# EAGLE design SilentStepStick-TMC2209_v20 (EAGLE 7.7.0)
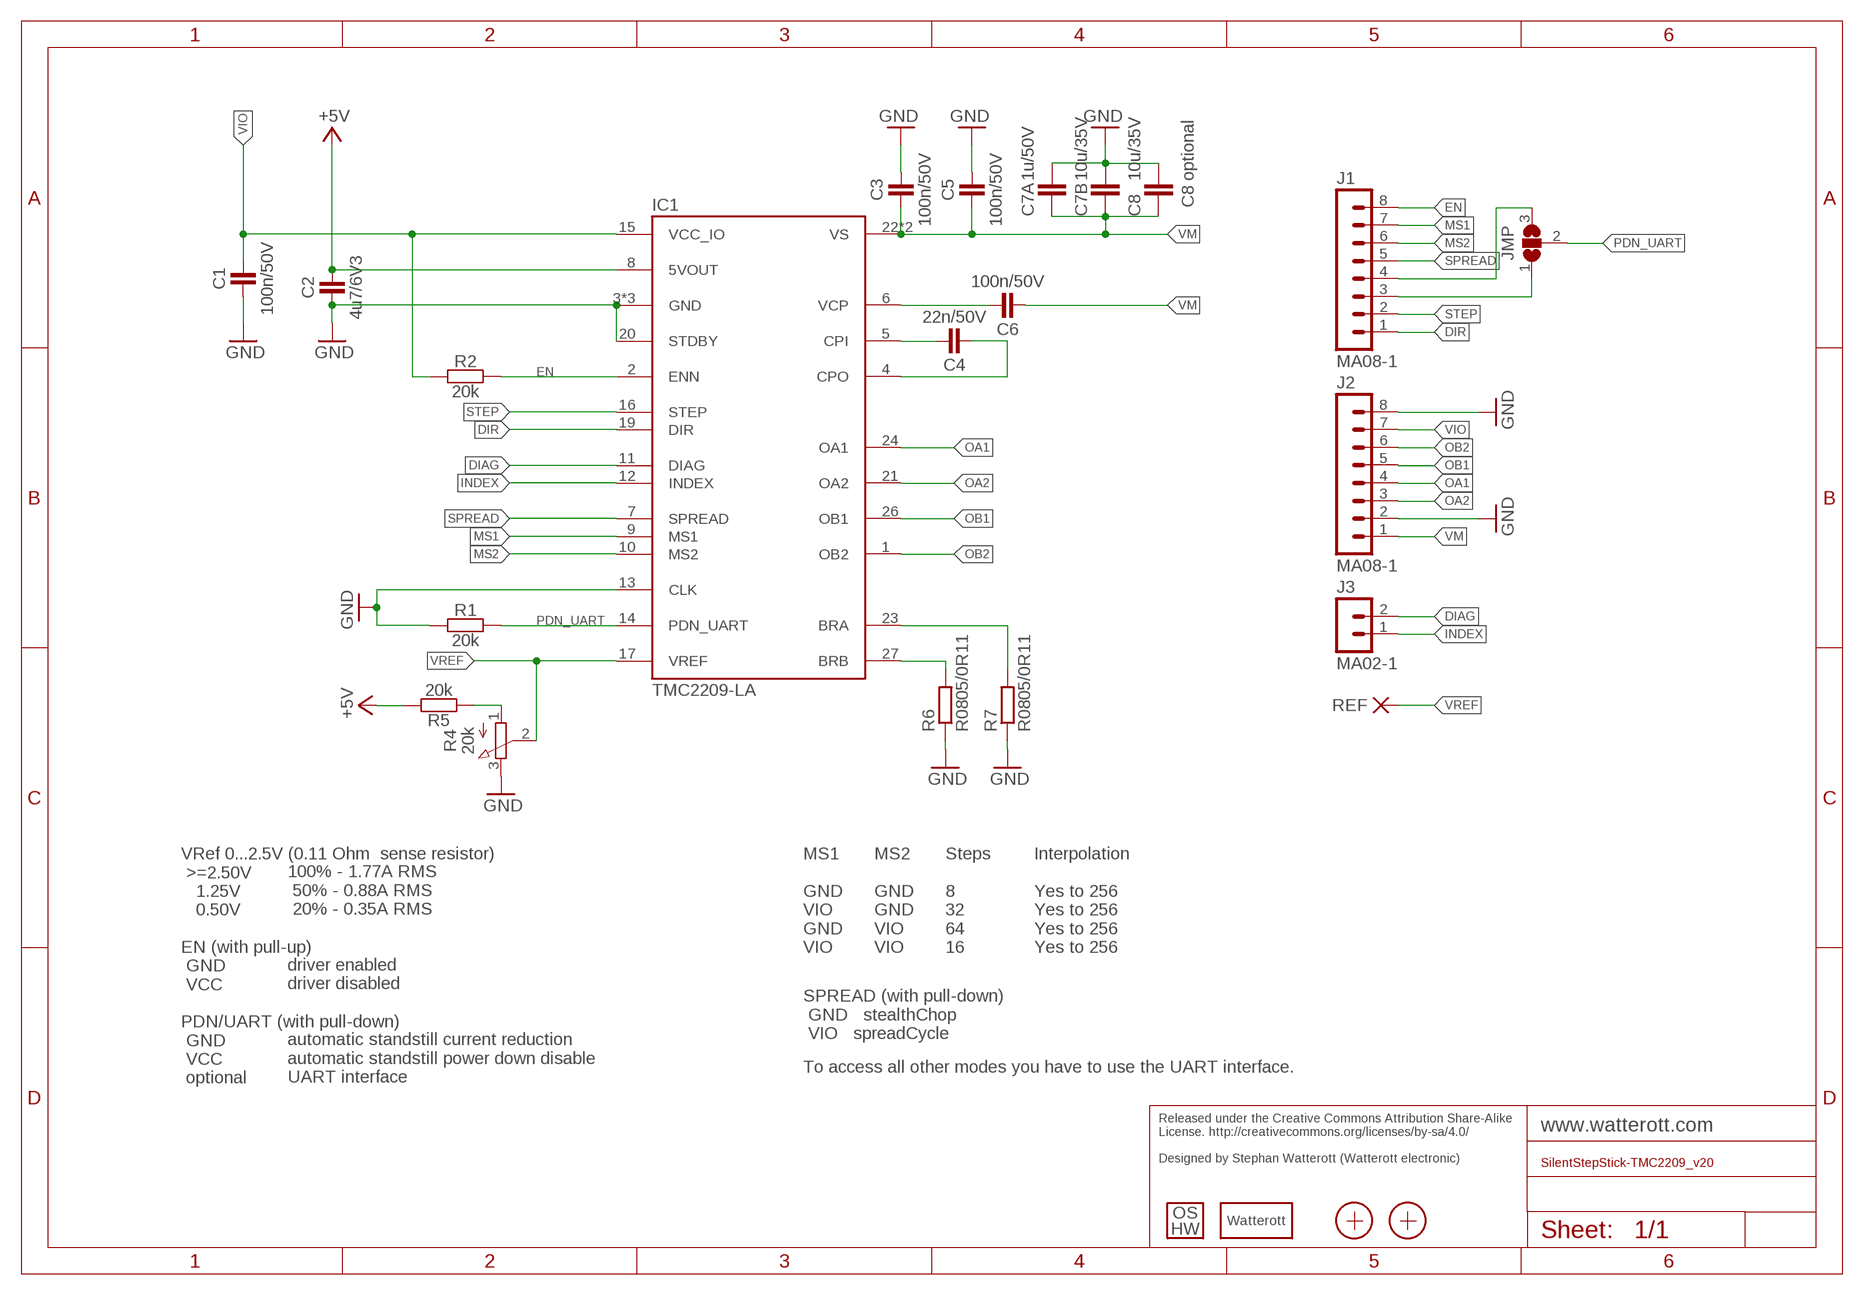
[diagram p0: schematic, sheet 1]

## Parts
C1  100n/50V  CAPACITOR-0402  [C0402]
C2  4u7/6V3  CAPACITOR-0402  [C0402]
C3  100n/50V  CAPACITOR-0402  [C0402]
C4  22n/50V  CAPACITOR-0402  [C0402]
C5  100n/50V  CAPACITOR-0402  [C0402]
C6  100n/50V  CAPACITOR-0402  [C0402]
C7A  1u/50V  C-EUC0805  [C0805]
C7B  10u/35V  C-EUC1206  [C1206]
C8  10u/35V  C-EUC1206  [C1206]
IC1  TMC2209-LA  [QFN28-PAD3.7]
J1  MA08-1  [MA08-1]
J2  MA08-1  [MA08-1]
J3  MA02-1  [MA02-1]
JMP  JUMPER3-0402-NC  [JUMPER3-0402_NC]
LOGO3  LOGO_SPARK-2  [SPARK_2MM]
LOGO4  LOGO_OSHW-2  [OSHW_2MM]
R1  20k  RESISTOR-0402  [C0402]
R2  20k  RESISTOR-0402  [C0402]
R4  20k  POT-EVM3R  [POT_EVM3R]
R5  20k  RESISTOR-0402  [C0402]
R6  R0805/0R11  R-EU_M0805  [M0805]
R7  R0805/0R11  R-EU_M0805  [M0805]
REF  PAD-0.6-1.1  [PAD-0.6-1.1]
X1  PASSER-04  [PASSER_04MM]
X2  PASSER-04  [PASSER_04MM]

## Nets
+5V: C2.2 IC1.8(5VOUT) R5.2
BRA: IC1.23(BRA) R7.2
BRB: IC1.27(BRB) R6.2
CPI: C4.2 IC1.5(CPI)
CPO: C4.1 IC1.4(CPO)
DIAG: IC1.11(DIAG) J3.2
DIR: IC1.19(DIR) J1.1
EN: IC1.2(ENN) J1.8 R2.2
GND: C1.1 C2.1 C3.2 C5.2 C7A.2 C7B.2 C8.2 IC1.3(GND) IC1.13(CLK) IC1.18(GND) IC1.20(STDBY) IC1.TP(GND) J2.2 J2.8 R1.1 R4.3(E) R6.1 R7.1
INDEX: IC1.12(INDEX) J3.1
MS1: IC1.9(MS1) J1.7
MS2: IC1.10(MS2) J1.6
N$1: J1.4 JMP.3
N$2: J1.3 JMP.1
OA1: IC1.24(OA1) J2.4
OA2: IC1.21(OA2) J2.3
OB1: IC1.26(OB1) J2.5
OB2: IC1.1(OB2) J2.6
PDN_UART: IC1.14(PDN_UART) JMP.2 R1.2
SPREAD: IC1.7(SPREAD) J1.5
STEP: IC1.16(STEP) J1.2
VCP: C6.2 IC1.6(VCP)
VIO: C1.2 IC1.15(VCC_IO) J2.7 R2.1
VM: C3.1 C5.1 C6.1 C7A.1 C7B.1 C8.1 IC1.22(VS) IC1.28(VS) J2.1
VREF: IC1.17(VREF) R4.2(S) REF.1(P)
VREF1: R4.1(A) R5.1

## Notes on the sheet
- C8 optional
- VRef 0...2.5V (0.11 Ohm  sense resistor)
   >=2.50V
     1.25V
     0.50V
  
  EN (with pull-up)
   GND
   VCC
  
  PDN/UART (with pull-down)
   GND
   VCC
   optional
- MS1
  
  GND
  VIO
  GND
  VIO
- MS2
  
  GND
  GND
  VIO
  VIO
- Steps
  
  8
  32
  64
  16
- Interpolation
  
  Yes to 256
  Yes to 256
  Yes to 256
  Yes to 256
- 100% - 1.77A RMS
   50% - 0.88A RMS
   20% - 0.35A RMS
  
  
  driver enabled
  driver disabled
  
  
  automatic standstill current reduction
  automatic standstill power down disable
  UART interface
- SPREAD (with pull-down)
   GND   stealthChop
   VIO   spreadCycle
- To access all other modes you have to use the UART interface.
- Released under the Creative Commons Attribution Share-Alike 
  License. http://creativecommons.org/licenses/by-sa/4.0/
  
  Designed by Stephan Watterott (Watterott electronic)

## Library data of the parts
C1-C6 = we-rcl:CAPACITOR: Capacitor ...2.2uF @ 6.3V -> 0402 ...4.7uF @ 6.3V -> 0603 ...10uF @ 16V -> 0805 ...22uF @ 25V -> 1206
C7A C7B C8 = rcl:C-EU: CAPACITOR, European symbol
IC1 = we-chip:TMC2209: Trinamic TMC2209 Stepper Motor Driver (5V...28V, 1.8A RMS, 256 microsteps)
J1 J2 = we-con:MA08-1: Pin Header
J3 = we-con:MA02-1: Pin Header
JMP = we-rcl:JUMPER3: 3-Pin Jumper
LOGO3 = we-symbol:LOGO_SPARK: Watterott electronic Logo
LOGO4 = we-symbol:LOGO_OSHW: Open-Source-Hardware Logo
R1 R2 R5 = we-rcl:RESISTOR: Resistor all kinds in 0402 and 0603
R4 = we-rcl:POT: Potentiometer
R6 R7 = rcl:R-EU_: RESISTOR, European symbol
REF = we-rcl:PAD: Pad / Test-Point
X1 X2 = we-symbol:PASSER: Fiducial Marker

## Board
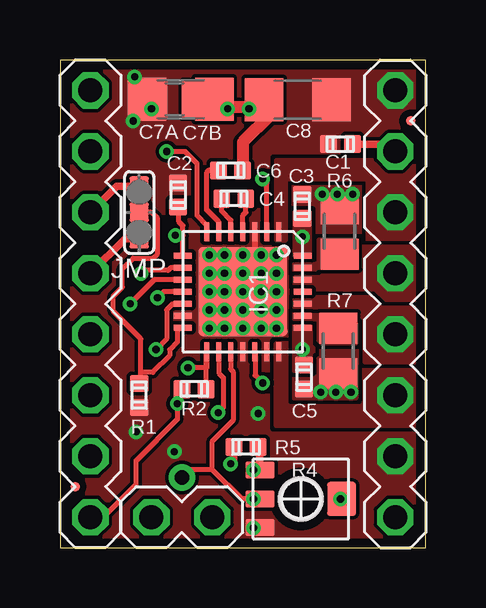
[diagram p1: board, top side]
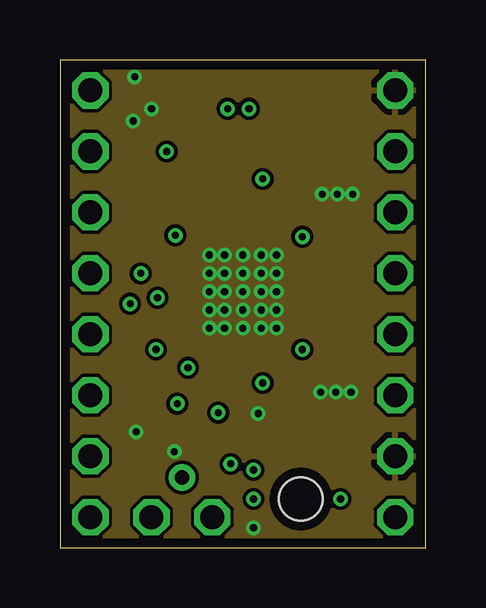
[diagram p2: board, inner layer Ground]
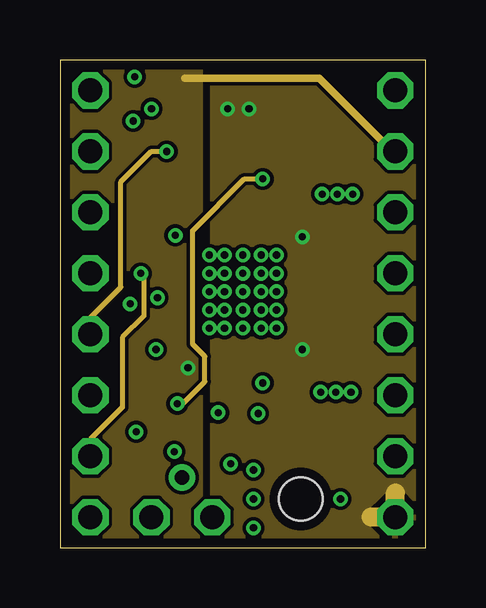
[diagram p3: board, inner layer Supply]
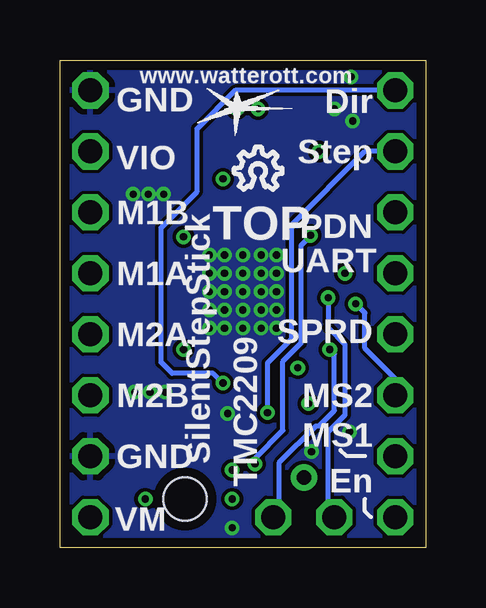
[diagram p4: board, bottom side, seen from below]

Size 15.24 x 20.32 mm. Coordinates in mm from the lower left corner, seen from the top.
Outline: 0,0 15.24,0 15.24,20.32 0,20.32 0,0
Copper layers (1+2*15+16): Top 0.035mm / dielectric 0.35mm / Ground 0.035mm / dielectric 0.76mm / Supply 0.035mm / dielectric 0.35mm / Bottom 0.035mm
Design rules "Default_WE_Euro *": minimum track width 0.15mm, minimum drill 0.25mm, track to track 0.15mm, track to pad 0.15mm, pad to pad 0.15mm, via to via 0.15mm, smd to smd 0mil, copper to edge 0.4mm, drill to drill 8mil, minimum pad ring 10mil, minimum via ring 6mil, stop-mask expansion 2mil, vias tented up to drill 0.5mm, thermal gap 10mil

### Footprints (pad centres in the part's own frame; a part is rotated, then mirrored left to right if it is on the bottom)
C0402 = smd 0.75 x 0.7: 1 0,0.5; 2 0,-0.5
C0805 = smd 1.3 x 1.5: 1 -0.95,0; 2 0.95,0
C1206 = smd 1.6 x 1.8: 1 -1.4,0; 2 1.4,0
QFN28-PAD3.7 = smd 0.8 x 0.26: 1 -2.5,1.5; 2 -2.5,1; 3 -2.5,0.5; 4 -2.5,0; 5 -2.5,-0.5; 6 -2.5,-1; 7 -2.5,-1.5; 15 2.5,-1.5; 16 2.5,-1; 17 2.5,-0.5; 18 2.5,0; 19 2.5,0.5; 20 2.5,1; 21 2.5,1.5 | smd 0.26 x 0.8: 8 -1.5,-2.5; 9 -1,-2.5; 10 -0.5,-2.5; 11 0,-2.5; 12 0.5,-2.5; 13 1,-2.5; 14 1.5,-2.5; 22 1.5,2.5; 23 1,2.5; 24 0.5,2.5; 25 0,2.5; 26 -0.5,2.5; 27 -1,2.5; 28 -1.5,2.5 | smd 3.7 x 3.7: TP 0,0
MA08-1 = drill 1 octagon: 1 0,8.89; 2 0,6.35; 3 0,3.81; 4 0,1.27; 5 0,-1.27; 6 0,-3.81; 7 0,-6.35; 8 0,-8.89
MA02-1 = drill 1 octagon: 1 0,1.27; 2 0,-1.27
JUMPER3-0402_NC = smd 0.8 x 0.8: 1 0,1.1; 2 0,0; 3 0,-1.1
POT_EVM3R = smd 0.7 x 1.2: 1 -1.2,-1.7; 2 0,-1.7; 3 1.2,-1.7 | smd 1.4 x 1.2: MOUNT 0,1.7 | hole 1.8: 0,0
M0805 = smd 1.3 x 1.6: 1 -0.95,0; 2 0.95,0
PAD-0.6-1.1 = drill 0.6 pad 1.1: 1 0,0
PASSER_04MM = smd 0.4 x 0.4: X 0,0

### Placement (x,y rotation side)
C1  11.68,16.82 90 top
C2  4.92,14.7 0 top
C3  10.1,14.22 180 top
C4  7.24,14.54 270 top
C5  10.16,7.11 0 top
C6  7.11,15.72 270 top
C7A  4.78,18.68 180 top
C7B  5.03,18.68 180 top
C8  9.91,18.67 0 top
IC1  7.62,10.67 270 top
J1  1.27,10.16 0 top
J2  13.97,10.16 180 top
J3  5.08,1.27 270 top
JMP  3.3,13.97 0 top
LOGO3  7.87,18.35 0 bottom
LOGO4  6.99,15.81 0 bottom
R1  3.3,6.35 180 top
R2  5.59,6.6 270 top
R4  10.03,2.03 270 top
R5  7.75,4.19 270 top
R6  11.65,13.18 270 top
R7  11.59,8.2 90 top
REF  5.08,2.92 0 top
X1  0.64,2.54 0 top
X2  14.61,17.78 0 top

### Tracks (layer width: path | path; a pad name or v marks a point on that pad's centre or on a via)
+5V  (via drill 0.3)
  Top 0.2: IC1.8 5.12,13.02 | 5.12,13.02 5.12,13.42 4.95,13.59 4.95,14.17 C2.2 | 5.12,13.02 v4.8,13.02
  Top 0.305: R5.2 7.25,3.63 v7.11,3.49
  Bottom 0.2: v4.8,13.02 4.8,12.99 5.21,12.59 5.21,8.51 5.96,7.76 5.96,4.89 7.11,3.73 v7.11,3.49
BRA
  pour Top (rank 3, no thermals): 9.78,9.78 12.32,9.78 12.32,8.51 10.92,8.51 10.79,8.64 10.79,9.53 9.78,9.53
BRB
  pour Top (rank 2, no thermals): 9.78,11.81 10.67,11.81 10.79,11.81 10.79,12.83 12.32,12.83 12.32,11.68 10.79,11.68 10.67,11.56 9.78,11.56
CPI
  Top 0.2: IC1.5 7.12,13.64 6.73,14.03 C4.2
CPO
  Top 0.2: IC1.4 7.62,13.84 7.75,13.97 C4.1
DIAG  (via drill 0.3)
  Top 0.2: IC1.11 4.32,10.67 v4.06,10.41
  Bottom 0.2: J3.2 4.06,1.52 4.06,4.83 3.37,5.52 3.37,8.46 4.06,9.16 v4.06,10.41
DIR  (via drill 0.3)
  Top 0.2: IC1.19 8.13,7.18 v8.45,6.86
  Bottom 0.2: J1.1 7.94,19.05 9.53,17.46 9.53,14.83 11.02,13.34 11.02,7.72 10.57,7.26 8.87,7.26 v8.46,6.86 v8.45,6.86
EN  (via drill 0.3)
  Top 0.2: IC1.2 8.62,15.19 v8.45,15.37 | J1.8 1.8,1.27 3.17,2.64 3.17,3.63 4.89,5.35 v4.89,6 4.89,6.41 R2.2
  Supply 0.2: v4.89,6 5.11,6 6.03,6.92 6.03,7.98 5.52,8.48 5.52,13.21 7.68,15.37 v8.45,15.37
GND  (via drill 0.3)
  Top 0.254: IC1.3 8.12,11.69 8.13,11.68
  other vias: 10.86,6.48 12.13,6.48 12.19,14.73 10.92,14.73 3.17,4.83 6.22,12.19 6.86,12.19 7.62,12.19 8.38,12.19 9.02,12.19 6.22,11.43 6.86,11.43 7.62,11.43 8.38,11.43 9.02,11.43 6.22,10.67 6.86,10.67 8.38,10.67 9.02,10.67 6.22,9.91 6.86,9.91 7.62,9.91 8.38,9.91 9.02,9.91 6.22,9.14 6.86,9.14 7.62,9.14 8.38,9.14 9.02,9.14 8.26,5.59 11.49,6.48 11.56,14.73 8.06,0.83 4.76,4 3.05,17.78 7.62,10.67 3.11,19.62 3.81,18.29
  pour Top (rank 3, no thermals): 9.78,7.11 10.79,7.11 10.79,7.87 12.32,7.87 12.32,6.22 9.78,6.22
  pour Top (rank 4, no thermals): 9.78,14.35 10.79,14.35 10.79,13.46 12.45,13.46 12.45,14.99 9.78,14.99
  pour Top (rank 6, no thermals): 0,0 15.24,0 15.24,20.32 0,20.32
  pour Ground: 0,20.32 15.24,20.32 15.24,0 0,0
  pour Bottom: 0,0 15.24,0 15.24,20.32 0,20.32
INDEX  (via drill 0.3)
  Top 0.17: IC1.12 4.7,10.16
  Top 0.2: IC1.12 | 4.7,10.16 4.45,9.91 4.45,8.7 v4,8.26
  Bottom 0.2: J3.1 6.1,1.52 6.1,3.56 4.57,5.08 4.45,5.08 3.81,5.71 3.81,8.06 v4,8.26
MOUNT  (via drill 0.3)
  other vias: 11.68,2.03
MS1  (via drill 0.3)
  Top 0.2: IC1.9 4.62,11.67 4.51,11.56 3.49,11.56 v3.37,11.43
  Supply 0.2: v3.37,11.43 3.49,11.3 3.49,9.65 2.6,8.76 2.6,5.84 1.27,4.51 J1.7
MS2  (via drill 0.3)
  Top 0.2: IC1.10 3.93,11.17 v2.92,10.16
  Bottom 0.2: v2.92,10.16 2.54,9.78 2.54,8.32 1.27,7.05 J1.6
N$1
  Top 0.305: JMP.3 2.71,12.87 J1.4
N$2
  Top 0.305: JMP.1 2.37,15.07 J1.3
OA1
  pour Top (rank 2, no thermals): 9.78,10.03 12.19,10.03 12.7,9.53 12.7,7.75 15.24,7.75 15.24,10.03 13.46,10.03 12.95,10.54 9.78,10.54
OA2
  pour Top (rank 5, no thermals): 9.53,8.51 9.53,5.97 12.7,5.97 12.7,7.49 15.24,7.49 15.24,5.08 9.02,5.08 9.02,8.51
OB1
  pour Top (no thermals): 9.78,11.24 9.78,10.79 13.14,10.79 13.59,10.35 15.24,10.35 15.24,12.51 11.81,12.51 11.05,11.43 10.86,11.24
OB2
  pour Top (rank 5, no thermals): 9.02,12.83 9.4,12.83 9.4,15.37 12.83,15.37 12.83,12.83 15.24,12.83 15.24,16.13 9.02,16.13
PDN_UART
  Top 0.2: IC1.14 5.14,9.14 4.89,9.14 4.89,8.57 4.57,8.26 4.57,8 3.87,7.3 3.37,7.3 | R1.2 3.37,6.91 3.37,7.3 | 3.37,7.3 3.37,8.7 2.22,9.84 2.22,10.48 2.6,10.86 2.6,11.62 3.05,12.06 3.87,12.06 4.06,12.26 4.06,13.72 3.81,13.97 JMP.2
SPREAD  (via drill 0.3)
  Top 0.2: IC1.7 6.12,13.44 5.71,13.84 5.71,16 5.21,16.51 v4.45,16.51
  Supply 0.2: J1.5 1.27,9.59 2.54,10.86 2.54,15.24 3.81,16.51 v4.45,16.51
STEP  (via drill 0.3)
  Top 0.2: IC1.16 6.62,7.27 6.81,7.09 6.81,5.84 v6.59,5.63
  Bottom 0.2: J1.2 2.54,16.51 5.59,13.46 5.59,8.7 6.59,7.7 v6.59,5.63
VCP
  Top 0.2: IC1.6 6.62,13.57 6.1,14.1 6.1,15.62 6.19,15.72 C6.2
VIO  (via drill 0.3)
  Top 0.2: 6.1,7.49 6.1,8.14 IC1.15 6.12,7.52 6.1,7.49 | 6.1,7.49 v5.33,7.49 | R2.1 6.09,7.49 6.1,7.49
  Top 0.305: C1.2 13.66,16.82 J2.7
  Supply 0.305: J2.7 13.84,16.51 10.79,19.56 5.21,19.56
  pour Supply: 0,20.32 5.84,20.32 5.84,0 0,0
VM  (via drill 0.3)
  Top 0.508: C6.1 7.62,16.89 8.78,18.05 8.78,18.4 C8.1 8.26,18.67 v7.87,18.29 7.81,18.29 7.81,18.35 6.99,18.35 v6.99,18.29 6.59,18.68 C7B.1 C7A.1
  Top 0.61: C6.1
  Supply 0.8: 12.95,1.27 J2.1 13.97,2.29
  other vias: 10.1,8.26 10.1,12.95
  pour Top (rank 4, no thermals): 9.78,9.27 10.54,9.27 10.54,7.37 9.78,7.37
  pour Top (rank 3, no thermals): 10.41,12.19 10.41,13.97 9.78,13.97 9.78,12.19
  pour Supply: 15.24,0 15.24,20.32 6.35,20.32 6.35,0
VREF  (via drill 0.3)
  Top 0.2: IC1.17 7.11,7.44 7.21,7.34 7.21,5.31 6.35,4.45 6.35,3.25 | R4.2 v8.06,2.03 7.57,2.03 6.35,3.25 | 6.35,3.25 5.41,3.25 REF.1
VREF1  (via drill 0.3)
  Top 0.2: 8.33,4.11 R5.1 | v8.06,3.24 R4.1
  Top 0.305: R4.1 8.33,4.11

### Text on the board
bPlace: www.watterott.com | Dir | GND | Step | VIO | PDN | TOP | M1B | UART | M1A | SPRD | M2A | MS2 | M2B | MS1 | En | TMC2209 | SilentStepStick | GND | VM
Document: Dir | GND | Step | Vio - 3.3-5V | PDN/UART | Motor Coil 1-B | Motor Coil 1-A | SPREAD | Motor Coil 2-A | MS2 | Motor Coil 2-B | MS1 | GND | En | Vm | DIAG | Vref | INDEX
Reference: Silkscreen: 22 bPlace